# Altium schematic sheet АДН175.03.50.000(С Рама) Э4.SchDoc
size 604 x 426 mm; Date: 8; ApprovedBy: Фадеев; Author: Фадеев; CompanyName: 5; DrawnBy: Заикин; Engineer: Монтволинская; Organization: 12; Address2: 2; Address3: 3; Address4: схема электрическая соединений; DocumentNumber: АДН175.03.50.000 Э4; Revision: АДН175.03.50.000; SheetNumber: 1; SheetTotal: 1; Обозначение: АДН175.03.50.000 Э4; Формат: А2; Document type: Электрические структурные AltiumDesigner; PageSetup: Record=PageOptions|CenterHorizontal=True|CenterVertical=True|PrintScale=0.66|XCorrection=1.00|YCorrection=1.00|PrintKind=1|BorderSize=5000000|LeftOffset=0|BottomOffset=0|Orientation=2|PaperLength=1000|PaperWidth=1000|Scale=100|PaperSource=7|PrintQuality=-3|MediaType=1|DitherType=10|PrintScaleMode=1|PaperKind=A3|PaperIndex=8; CurrentTime: 7; CurrentDate: 6; Time: 17; DocumentFullPathAndName: 9; ModifiedDate: 11; ImagePath: 10; ProjectName: 13; Application_BuildNumber: 4
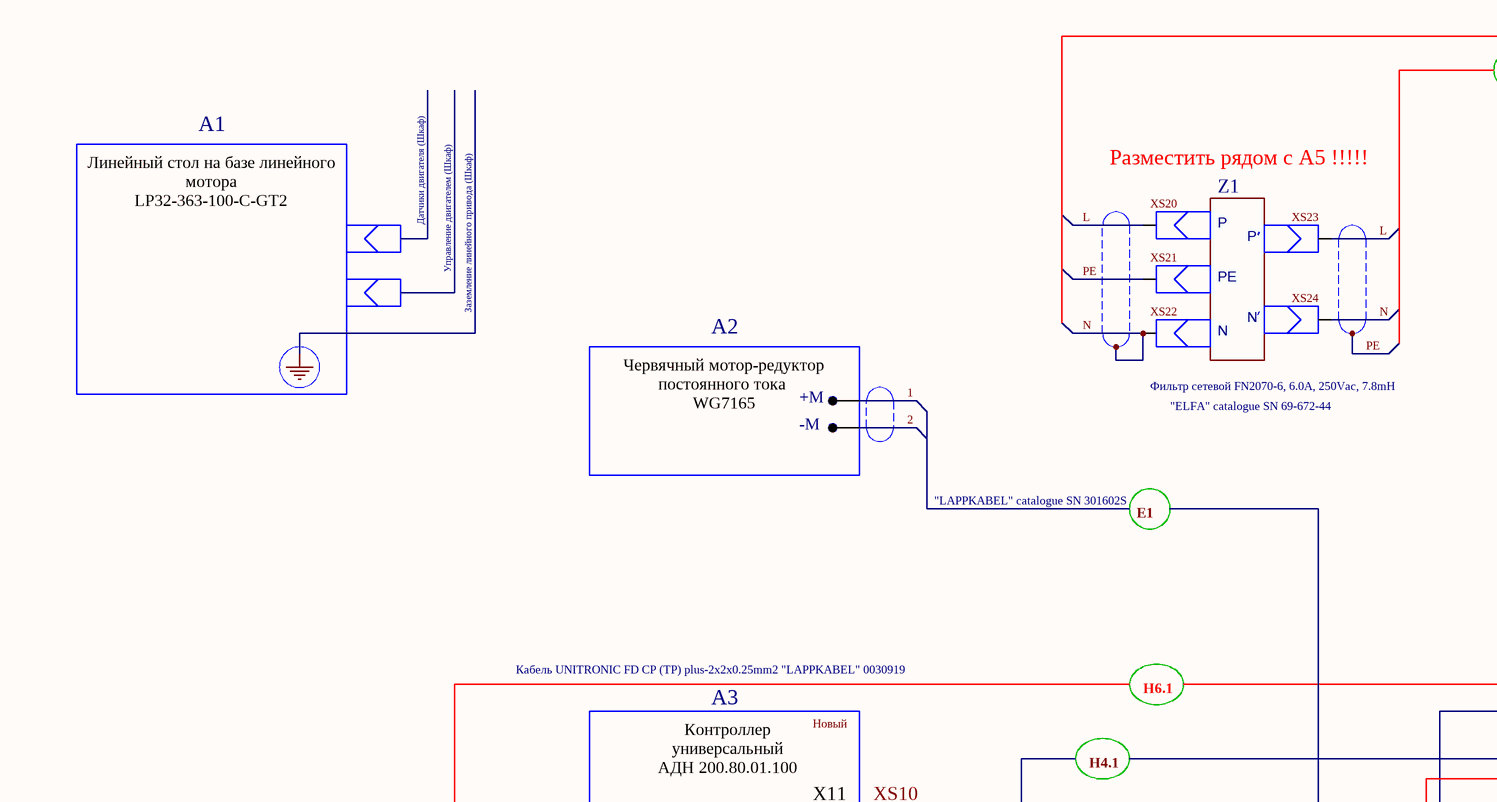
[diagram p0: АДН175.03.50.000(С Рама) Э4.SchDoc, top left]
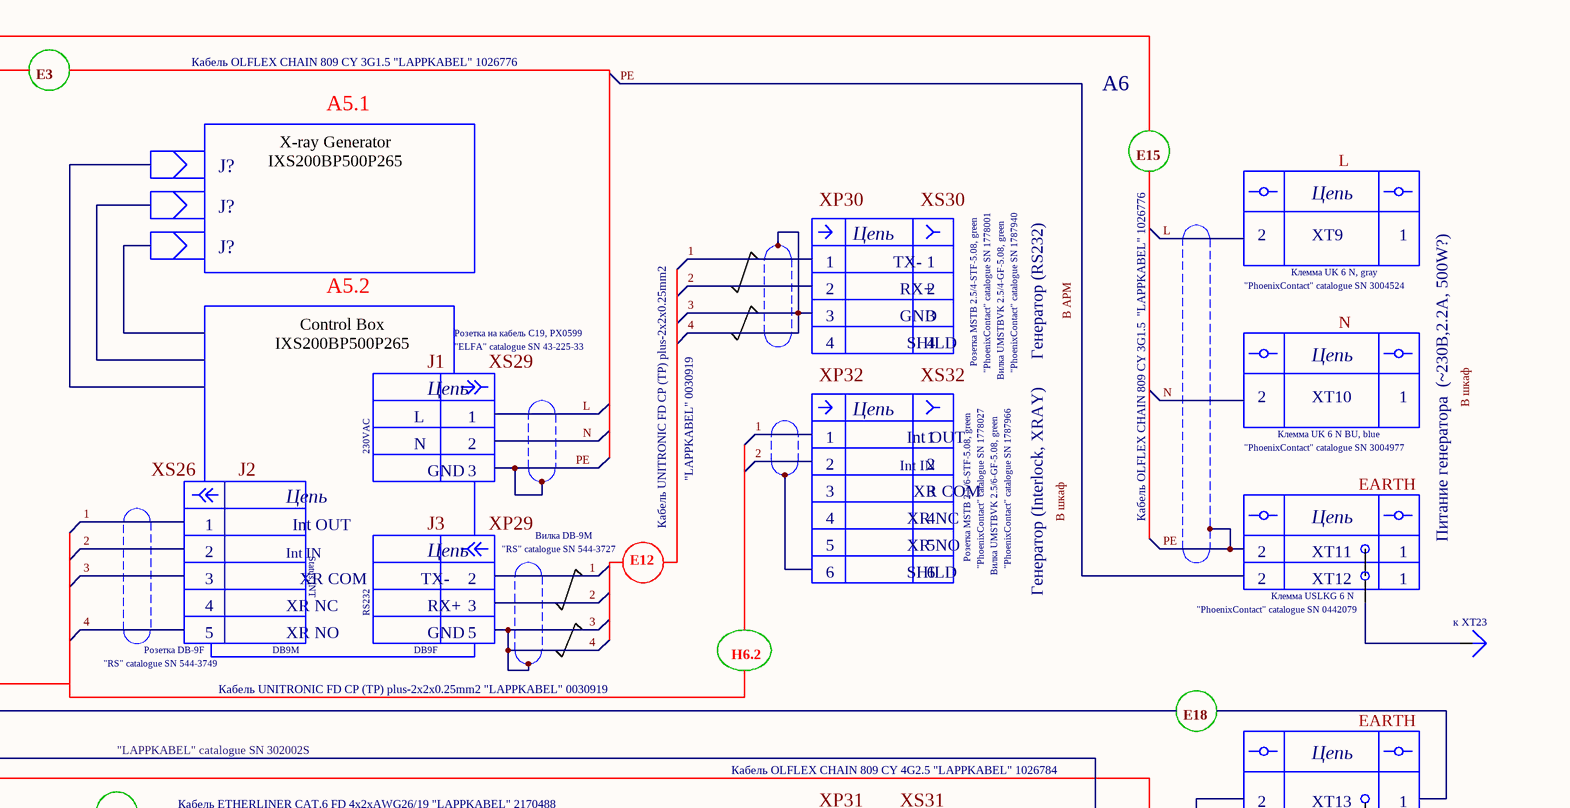
[diagram p1: АДН175.03.50.000(С Рама) Э4.SchDoc, top right]
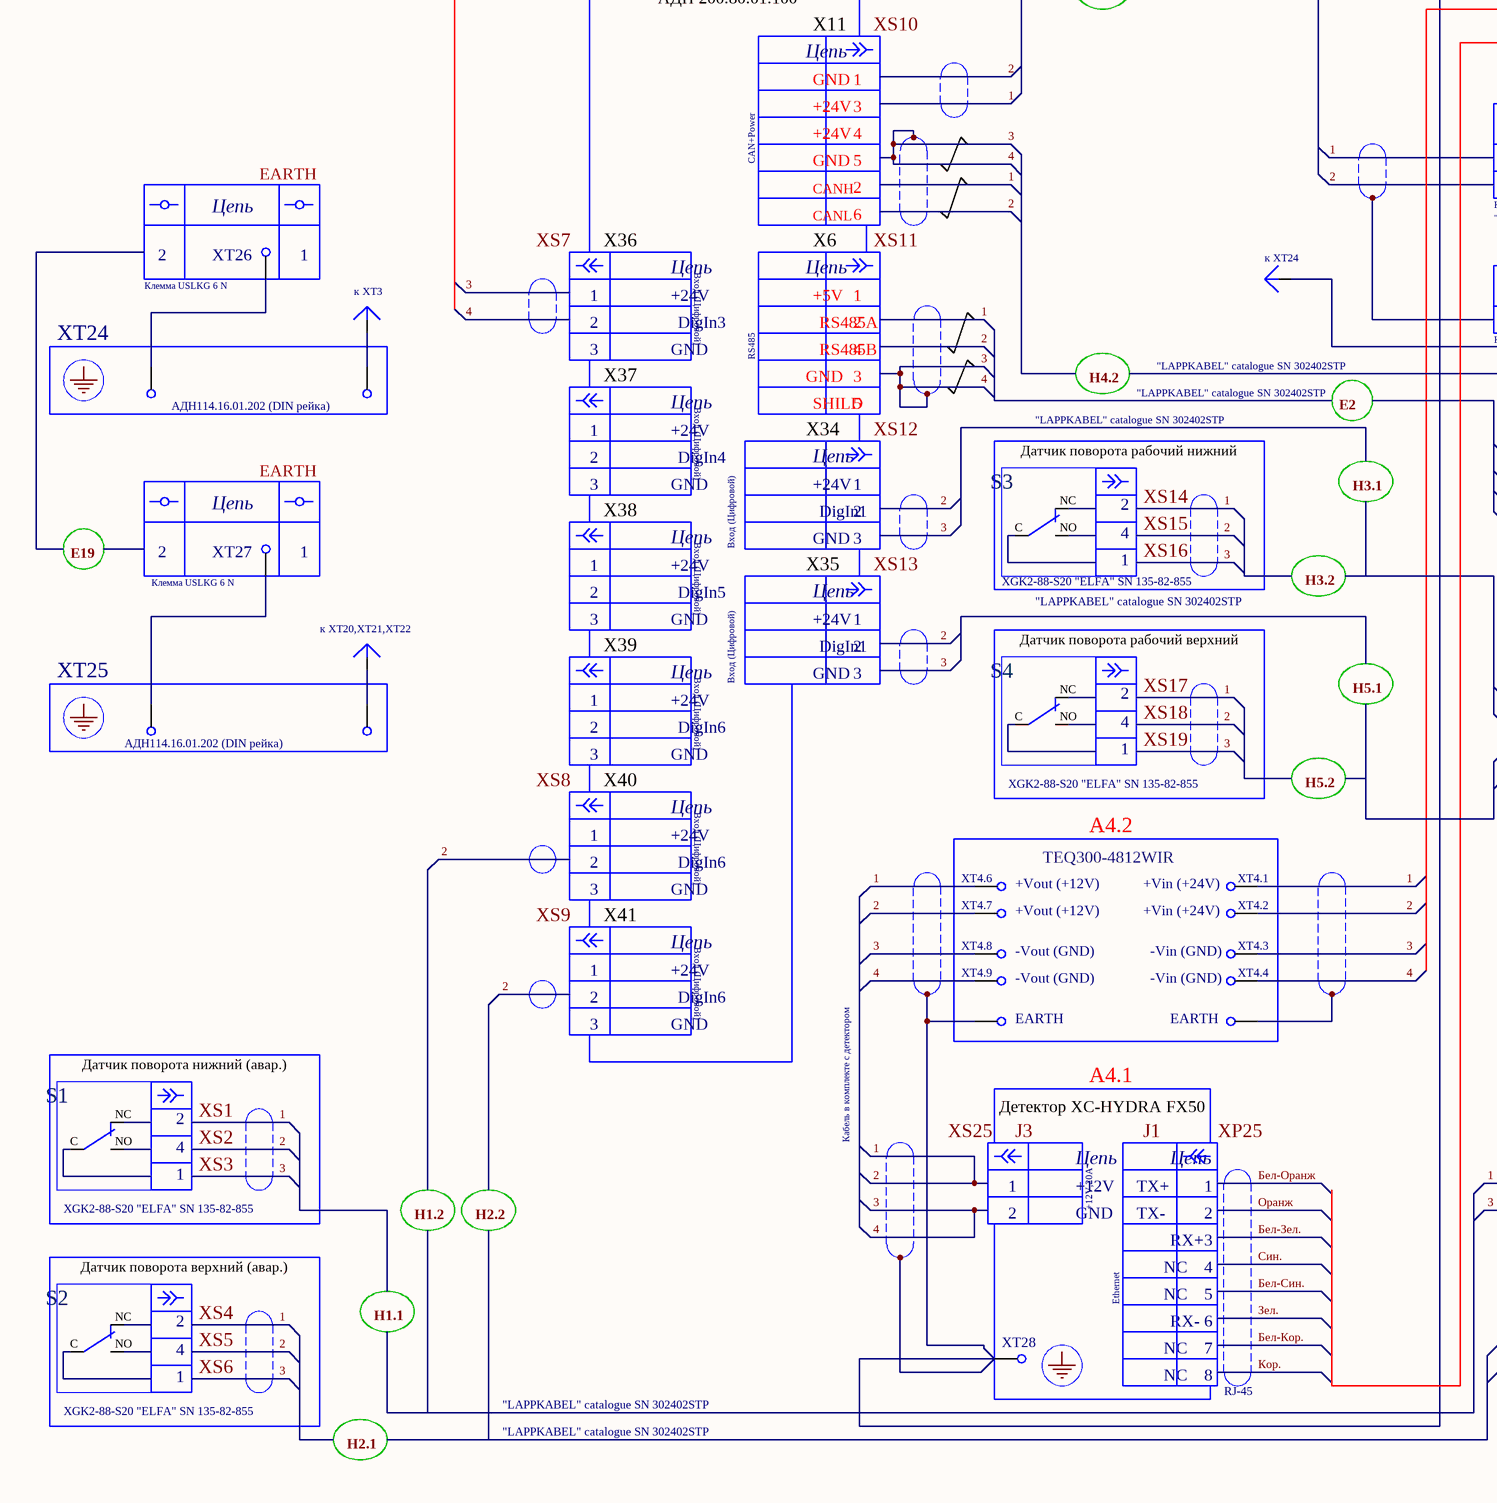
[diagram p2: АДН175.03.50.000(С Рама) Э4.SchDoc, bottom left]
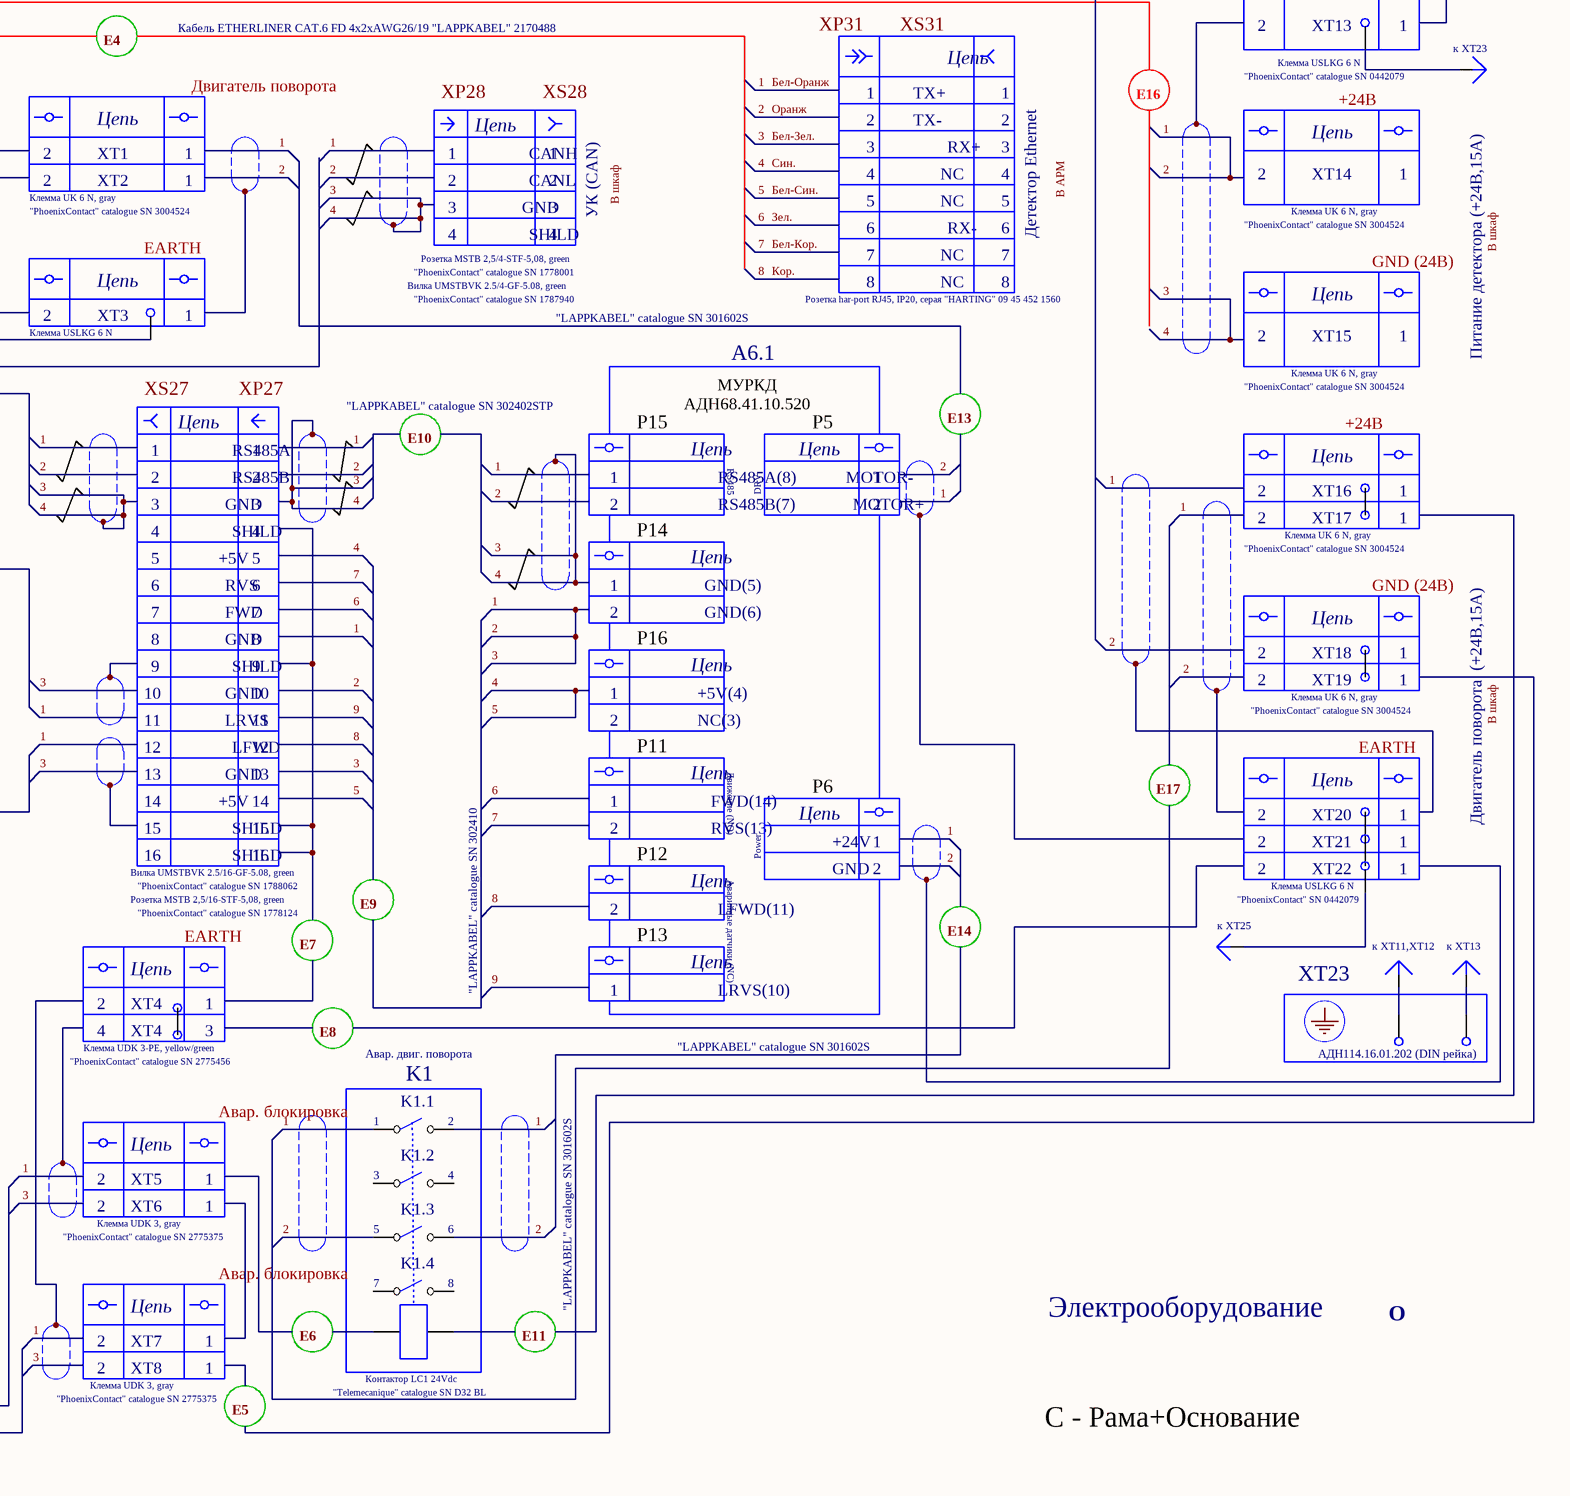
[diagram p3: АДН175.03.50.000(С Рама) Э4.SchDoc, bottom right]

## Parts
(Parts that share a designator on the sheet are numbered #1, #2 ... from top to bottom, then left to right.)
+M  КОНТ_ПЛ_1  [PLS-1]  (value not drawn)
+Vin_(+24V)#1  XT4.1  [PLS-1]
+Vin_(+24V)#2  XT4.2  [PLS-1]
+Vout_(+12V)#1  XT4.6  [PLS-1]
+Vout_(+12V)#2  XT4.7  [PLS-1]
-M  КОНТ_ПЛ_1  [PLS-1]  (value not drawn)
-Vin_(GND)#1  XT4.3  [PLS-1]
-Vin_(GND)#2  XT4.4  [PLS-1]
-Vout_(GND)#1  XT4.8  [PLS-1]
-Vout_(GND)#2  XT4.9  [PLS-1]
EARTH#1  КОНТ_ПЛ_1  [PLS-1]  (value not drawn)
EARTH#2  КОНТ_ПЛ_1  [PLS-1]  (value not drawn)
J?#1  (no value)
J?#2  (no value)
J?#3  RS232  (value not drawn)
J?#4  (no value)
J?#5  RS232  (value not drawn)
K1  RELAY  (value not drawn)
K1.1  1
K1.2  3
K1.3  5
K1.4  7
SW?#1  SW2_2  (value not drawn)
SW?#2  SW2_2  (value not drawn)
SW?#3  SW2_2  (value not drawn)
SW?#4  SW2_2  (value not drawn)
XK?#1  КОНТ_ПЛ_1  [PLS-1]  (value not drawn)
XK?#2  КОНТ_ПЛ_1  [PLS-1]  (value not drawn)
XK?#3  КОНТ_ПЛ_1  [PLS-1]  (value not drawn)
XK?#4  КОНТ_ПЛ_1  [PLS-1]  (value not drawn)
XK?#5  КОНТ_ПЛ_1  [PLS-1]  (value not drawn)
XK?#6  КОНТ_ПЛ_1  [PLS-1]  (value not drawn)
XK?#7  КОНТ_ПЛ_1  [PLS-1]  (value not drawn)
XK?#8  КОНТ_ПЛ_1  [PLS-1]  (value not drawn)
XK?#9  КОНТ_ПЛ_1  [PLS-1]  (value not drawn)
XK?#10  КОНТ_ПЛ_1  [PLS-1]  (value not drawn)
XK?#11  КОНТ_ПЛ_1  [PLS-1]  (value not drawn)
XK?#12  КОНТ_ПЛ_1  [PLS-1]  (value not drawn)
XK?#13  КОНТ_ПЛ_1  [PLS-1]  (value not drawn)
XK?#14  КОНТ_ПЛ_1  [PLS-1]  (value not drawn)
XK?#15  КОНТ_ПЛ_1  [PLS-1]  (value not drawn)
XK?#16  КОНТ_ПЛ_1  [PLS-1]  (value not drawn)
XK?#17  КОНТ_ПЛ_1  [PLS-1]  (value not drawn)
XK?#18  КОНТ_ПЛ_1  [PLS-1]  (value not drawn)
XK?#19  КОНТ_ПЛ_1  [PLS-1]  (value not drawn)
XK?#20  КОНТ_ПЛ_1  [PLS-1]  (value not drawn)
XK?#21  КОНТ_ПЛ_1  [PLS-1]  (value not drawn)
XK?#22  КОНТ_ПЛ_1  [PLS-1]  (value not drawn)
XK?#23  КОНТ_ПЛ_1  [PLS-1]  (value not drawn)
XK?#24  КОНТ_ПЛ_1  [PLS-1]  (value not drawn)
XT28  КОНТ_ПЛ_1  [PLS-1]  (value not drawn)
Z1  Filter  (value not drawn)
к_XT3  Клемма PCB  (value not drawn)
к_XT11,XT12  Клемма PCB  (value not drawn)
к_XT13  Клемма PCB  (value not drawn)
к_XT20,XT21,XT22  Клемма PCB  (value not drawn)
к_XT23#1  Клемма PCB  (value not drawn)
к_XT23#2  Клемма PCB  (value not drawn)
к_XT24  Клемма PCB  (value not drawn)
к_XT25  Клемма PCB  (value not drawn)

## Blocks framed on the sheet
A2: +M -M
Цепь: XK?#1-XK?#3
Цепь: XK?#4
Цепь: XK?#5
Цепь: XK?#6
XT24: XK?#7 XK?#8
S3: SW?#1
Цепь: XK?#9 XK?#10
Цепь: XK?#11
S4: SW?#2
Цепь: XK?#12 XK?#13
XT25: XK?#14 XK?#15
Цепь: XK?#16-XK?#20
A4.2: +Vin_(+24V)#1 +Vin_(+24V)#2 +Vout_(+12V)#1 +Vout_(+12V)#2 -Vin_(GND)#1 -Vin_(GND)#2 -Vout_(GND)#1 -Vout_(GND)#2 EARTH#1 EARTH#2
Цепь: XK?#21 XK?#22
XT23: XK?#23 XK?#24
S1: SW?#3
S2: SW?#4

## Nets
1: +M.1 +Vin_(+24V)#1.1 +Vin_(+24V)#2.1 +Vout_(+12V)#1.1 +Vout_(+12V)#2.1 -M.1 -Vin_(GND)#1.1 -Vin_(GND)#2.1 -Vout_(GND)#1.1 -Vout_(GND)#2.1 K1.1.1 K1.1.2 K1.3.1 K1.3.2  [also labelled 2, 3, 4, 5, Бел-Зел., Бел-Оранж, Бел-Син., Оранж, Син.]
L: Z1.1 Z1.4
N: Z1.3 Z1.?1
PE: Z1.2
NetXK?#3_1: XK?#3.1 к_XT23#1.1
NetXK?#4_1: XK?#4.1 к_XT23#2.1
NetXK?#5_1: XK?#5.1 XK?#7.1
NetXK?#6_1: XK?#6.1 к_XT24.1
NetXK?#8_1: XK?#8.1 к_XT3.1
NetXK?#11_1: XK?#11.1 XK?#14.1
NetXK?#15_1: XK?#15.1 к_XT20,XT21,XT22.1
NetXK?#16_1: XK?#16.1 XK?#19.1
NetXK?#20_1: XK?#20.1 к_XT25.1
NetXK?#23_1: XK?#23.1 к_XT11,XT12.1
NetXK?#24_1: XK?#24.1 к_XT13.1

Not connected (* = marked no-connect by the designer): EARTH#1 1; EARTH#2 1; J?#1 ?1; J?#2 ?1; J?#3 ?1; J?#4 ?1; J?#5 ?1; K1 A1 A2; K1.2 1 2; K1.4 1 2; SW?#1 C(1) NC(2) NO(4); SW?#2 C(1) NC(2) NO(4); SW?#3 C(1) NC(2) NO(4); SW?#4 C(1) NC(2) NO(4); XK?#1 1; XK?#2 1; XK?#9 1; XK?#10 1; XK?#12 1; XK?#13 1; XK?#17 1; XK?#18 1; XK?#21 1; XK?#22 1; XT28 1

## Notes on the sheet
- A1
- E3
- Кабель OLFLEX CHAIN 809 CY 3G1.5 "LAPPKABEL" 1026776
- A5.1
- A6
- Разместить рядом с A5 !!!!!
- X-ray Generator
  IXS200BP500P265
- E15
- L
- Линейный стол на базе линейного мотора
  LP32-363-100-C-GT2
- (near J?#3) Датчики двигателя (Шкаф)
- (near J?#3) Управление двигателем (Шкаф)
- XP30
- 1
- Цепь
- TX-
- XS30
- 2
- XT9
- Заземление линейного привода (Шкаф)
- A5.2
- 3
- GND
- RX+
- В АРМ
- "PhoenixContact" catalogue SN 3004524
- Клемма UK 6 N, gray
- N
- (near Z1) Фильтр сетевой FN2070-6, 6.0A, 250Vac, 7.8mH
- Control Box
  IXS200BP500P265
- J1
- Розетка на кабель C19, PX0599
- "ELFA" catalogue SN 43-225-33
- XS29
- XP32
- 4
- SHILD
- XS32
- Розетка MSTB 2.5/4-STF-5.08, green
- "PhoenixContact" catalogue SN 1778001
- Вилка UMSTBVK 2.5/4-GF-5.08, green
- "PhoenixContact" catalogue SN 1787940
- Генератор (RS232)
- XT10
- В шкаф
- (near +M) Червячный мотор-редуктор постоянного тока
  WG7165
- "ELFA" catalogue SN 69-672-44
- 230VAC
- Int OUT
- "PhoenixContact" catalogue SN 3004977
- Клемма UK 6 N BU, blue
- "LAPPKABEL" catalogue SN 301602S
- E1
- XS26
- J2
- J3
- XP29
- Вилка DB-9M
- Кабель UNITRONIC FD CP (TP) plus-2х2х0.25mm2
- "LAPPKABEL" 0030919
- Int IN
- XR NC
- XR COM
- Кабель OLFLEX CHAIN 809 CY 3G1.5  "LAPPKABEL" 1026776
- EARTH
- Питание генератора  (~230В,2.2А, 500W?)
- Status,INT
- "RS" catalogue SN 544-3727
- E12
- 6
- 5
- XR NO
- Розетка MSTB 2.5/6-STF-5.08, green
- "PhoenixContact" catalogue SN 1778027
- Вилка UMSTBVK 2.5/6-GF-5.08, green
- "PhoenixContact" catalogue SN 1787966
- Генератор (Interlock, XRAY)
- (near XK?#3) Клемма USLKG 6 N
- (near XK?#1) XT11
- (near XK?#2) XT12
- (near XK?#1) 1
- (near XK?#2) 1
- Кабель UNITRONIC FD CP (TP) plus-2х2х0.25mm2 "LAPPKABEL" 0030919
- "RS" catalogue SN 544-3749
- Розетка DB-9F
- DB9M
- RS232
- DB9F
- H6.2
- (near XK?#3) "PhoenixContact" catalogue SN 0442079
- A3
- Новый
- H6.1
- E18
- Контроллер универсальный
  АДН 200.80.01.100
- X11
- XS10
- H4.1
- "LAPPKABEL" catalogue SN 302002S
- Кабель ETHERLINER CAT.6 FD 4x2xAWG26/19 "LAPPKABEL" 2170488
- Кабель OLFLEX CHAIN 809 CY 4G2.5 "LAPPKABEL" 1026784
- XP31
- XS31
- (near XK?#4) XT13
- (near XK?#4) 1
- E4
- Двигатель поворота
- "PhoenixContact" catalogue SN 0442079
- (near XK?#4) Клемма USLKG 6 N
- CAN+Power
- +24V
- XT1
- XP28
- CANH
- XS28
- TX+
- E16
- +24В
- CANL
- XT2
- УК (CAN)
- NC
- XT14
- (near XK?#5) Клемма USLKG 6 N
- (near XK?#5) XT26
- (near XK?#5) 1
- XS7
- X36
- Вход (Цифровой)
- X6
- +5V
- XS11
- Розетка MSTB 2,5/4-STF-5,08, green
- Розетка har-port RJ45, IP20, серая "HARTING" 09 45 452 1560
- 7
- 8
- RX-
- Детектор Ethernet
- GND (24В)
- DigIn3
- RS485
- RS485B
- RS485A
- "LAPPKABEL" catalogue SN 302402STP
- (near XK?#6) Клемма USLKG 6 N
- (near XK?#6) XT3
- (near XK?#6) 1
- A6.1
- XT15
- (near к_XT23#2) Питание детектора (+24В,15А)
- (near XK?#7) АДН114.16.01.202 (DIN рейка)
- X37
- X34
- XS12
- H4.2
- E2
- XS27
- XP27
- P15
- МУРКД
  АДН68.41.10.520
- P5
- E13
- DigIn4
- (near SW?#1) Датчик поворота рабочий нижний
- XS14
- H3.1
- E10
- RS485A(8)
- DRV
- MOTOR-
- (near XK?#9) XT16
- (near XK?#9) 1
- E19
- (near XK?#11) XT27
- (near XK?#11) 1
- X38
- X35
- DigIn1
- XS13
- XS16
- XS15
- P14
- RS485B(7)
- MOTOR+
- (near XK?#10) "PhoenixContact" catalogue SN 3004524
- (near XK?#10) Клемма UK 6 N, gray
- (near XK?#10) XT17
- (near XK?#10) 1
- (near XK?#11) Клемма USLKG 6 N
- DigIn5
- (near SW?#1) XGK2-88-S20 "ELFA" SN 135-82-855
- H3.2
- FWD
- RVS
- GND(6)
- GND(5)
- X39
- (near SW?#2) Датчик поворота рабочий верхний
- XS17
- H5.1
- 10
- 9
- P16
- +5V(4)
- (near XK?#13) Клемма UK 6 N, gray
- (near XK?#12) XT18
- (near XK?#13) XT19
- (near XK?#12) 1
- (near XK?#13) 1
- (near XK?#14) АДН114.16.01.202 (DIN рейка)
- DigIn6
- XS19
- XS18
- 11
- 12
- LRVS
- LFWD
- P11
- NC(3)
- Движение (NO)
- (near XK?#13) "PhoenixContact" catalogue SN 3004524
- XS8
- X40
- XGK2-88-S20 "ELFA" SN 135-82-855
- H5.2
- 13
- 14
- 15
- RVS(13)
- FWD(14)
- P6
- E17
- (near XK?#16) XT20
- (near XK?#16) 1
- Двигатель поворота  (+24В,15А)
- TEQ300-4812WIR
- Вилка UMSTBVK 2.5/16-GF-5.08, green
- Розетка MSTB 2,5/16-STF-5,08, green
- "PhoenixContact" catalogue SN 1788062
- 16
- P12
- Аварийные датчики (NC)
- Power
- (near XK?#20) "PhoenixContact" SN 0442079
- (near XK?#20) Клемма USLKG 6 N
- (near XK?#17) XT21
- (near XK?#19) XT22
- (near XK?#17) 1
- (near XK?#19) 1
- XS9
- X41
- "PhoenixContact" catalogue SN 1778124
- E7
- E9
- P13
- LFWD(11)
- E14
- (near XK?#21) XT4
- (near XK?#22) XT4
- (near XK?#21) 1
- (near XK?#22) 3
- E8
- "LAPPKABEL" catalogue SN 302410
- LRVS(10)
- (near SW?#3) Датчик поворота нижний (авар.)
- XS1
- Детектор XC-HYDRA FX50
- A4.1
- (near XK?#22) "PhoenixContact" catalogue SN 2775456
- (near XK?#22) Клемма UDK 3-PE, yellow/green
- Авар. двиг. поворота
- (near XK?#23) АДН114.16.01.202 (DIN рейка)
- XS2
- XS3
- Кабель в комплекте с детектором
- XS25
- XP25
- Авар. блокировка
- (near K1.1) 2
- H1.2
- H2.2
- +12V
- +12V,20A
- "PhoenixContact" catalogue SN 2775375
- Клемма UDK 3, gray
- XT5
- XT6
- (near K1.2) 4
- (near K1.3) 6
- (near SW?#4) Датчик поворота верхний (авар.)
- Ethernet
- (near K1.4) 8
- XS4
- XS5
- XS6
- H1.1
- XT7
- XT8
- E6
- (near K1) Контактор LC1 24Vdc
- E11
- Электрооборудование
- O
- H2.1
- RJ-45
- E5
- "Telemecanique" catalogue SN D32 BL
- С - Рама+Основание
- Labels drawn without touching a wire or pin: GND, XS20, XS21, XS22, XS23, XS24
- Перв. примен.
- Справ. №
- Подп. и дата
- Инв. № дубл.
- Взам. инв. №
- Изм.
- Лист
- № докум.
- Подп.
- Дата
- Лит.
- Масса
- Масштаб
- Разраб.
- Т. контр.
- Пров.
- Листов
- Инв. № подл.
- Н. контр.
- Утв.
- Формат А2
- (in symbol Filter) P; PE; N

## Library data of the parts
+Vin_(+24V)#1 +Vin_(+24V)#2 +Vout_(+12V)#1 +Vout_(+12V)#2 -Vin_(GND)#1 -Vin_(GND)#2 -Vout_(GND)#1 -Vout_(GND)#2 = КОНТ_ПЛ_1
J?#1-J?#5 = PLUGSOKET_1
K1.1-K1.4 = SW-SPST
к_XT3 к_XT11,XT12 к_XT13 к_XT20,XT21,XT22 к_XT23#1 к_XT23#2 к_XT24 к_XT25 = Клемма PCB: Vendor Part: 257-849; Vendor: Farnell